# EAGLE design BIGDOGLAYOUT2 (EAGLE 7.2.0)
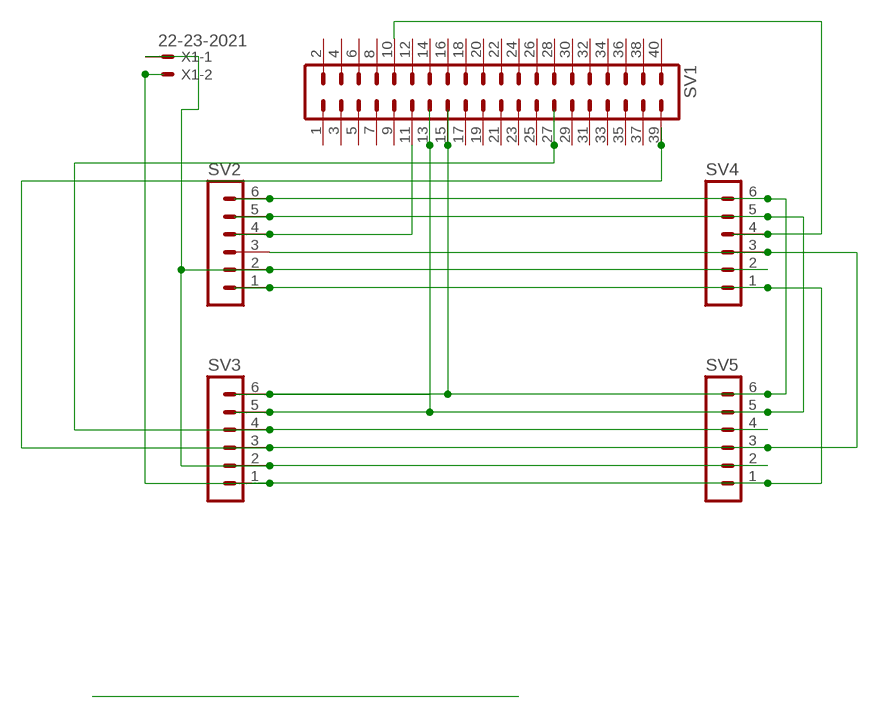
[diagram p0: schematic, sheet 1]

## Parts
SV1  MA20-2  [MA20-2]
SV2  MA06-1  [MA06-1]
SV3  MA06-1  [MA06-1]
SV4  MA06-1  [MA06-1]
SV5  MA06-1  [MA06-1]
X1  22-23-2021  [22-23-2021]

## Nets
N$1: SV1.11 SV2.4
N$2: SV1.10 SV4.4
N$3: SV2.2 SV3.2 SV4.2 SV5.2 X1.1
N$4: SV1.15 SV2.6 SV3.6 SV4.6 SV5.6
N$6: SV1.27 SV3.4 SV5.4
N$8: SV1.39 SV2.3 SV3.3 SV4.3 SV5.3
N$9: SV1.13 SV2.5 SV3.5 SV4.5 SV5.5
N$18: SV2.1 SV3.1 SV4.1 SV5.1 X1.2
Unconnected: SV1.1 SV1.2 SV1.3 SV1.4 SV1.5 SV1.6 SV1.7 SV1.8 SV1.9 SV1.12 SV1.14 SV1.16 SV1.17 SV1.18 SV1.19 SV1.20 SV1.21 SV1.22 SV1.23 SV1.24 SV1.25 SV1.26 SV1.28 SV1.29 SV1.30 SV1.31 SV1.32 SV1.33 SV1.34 SV1.35 SV1.36 SV1.37 SV1.38 SV1.40

## Library data of the parts
SV1 = con-lstb:MA20-2: PIN HEADER; OC_FARNELL: unknown; OC_NEWARK: unknown
SV2-SV5 = con-lstb:MA06-1: PIN HEADER; OC_FARNELL: unknown; OC_NEWARK: unknown
X1 = con-molex:22-23-2021: .100" (2.54mm) Center Header - 2 Pin; MF: MOLEX; MPN: 22-23-2021; OC_FARNELL: 1462926; OC_NEWARK: 25C3832

## Board
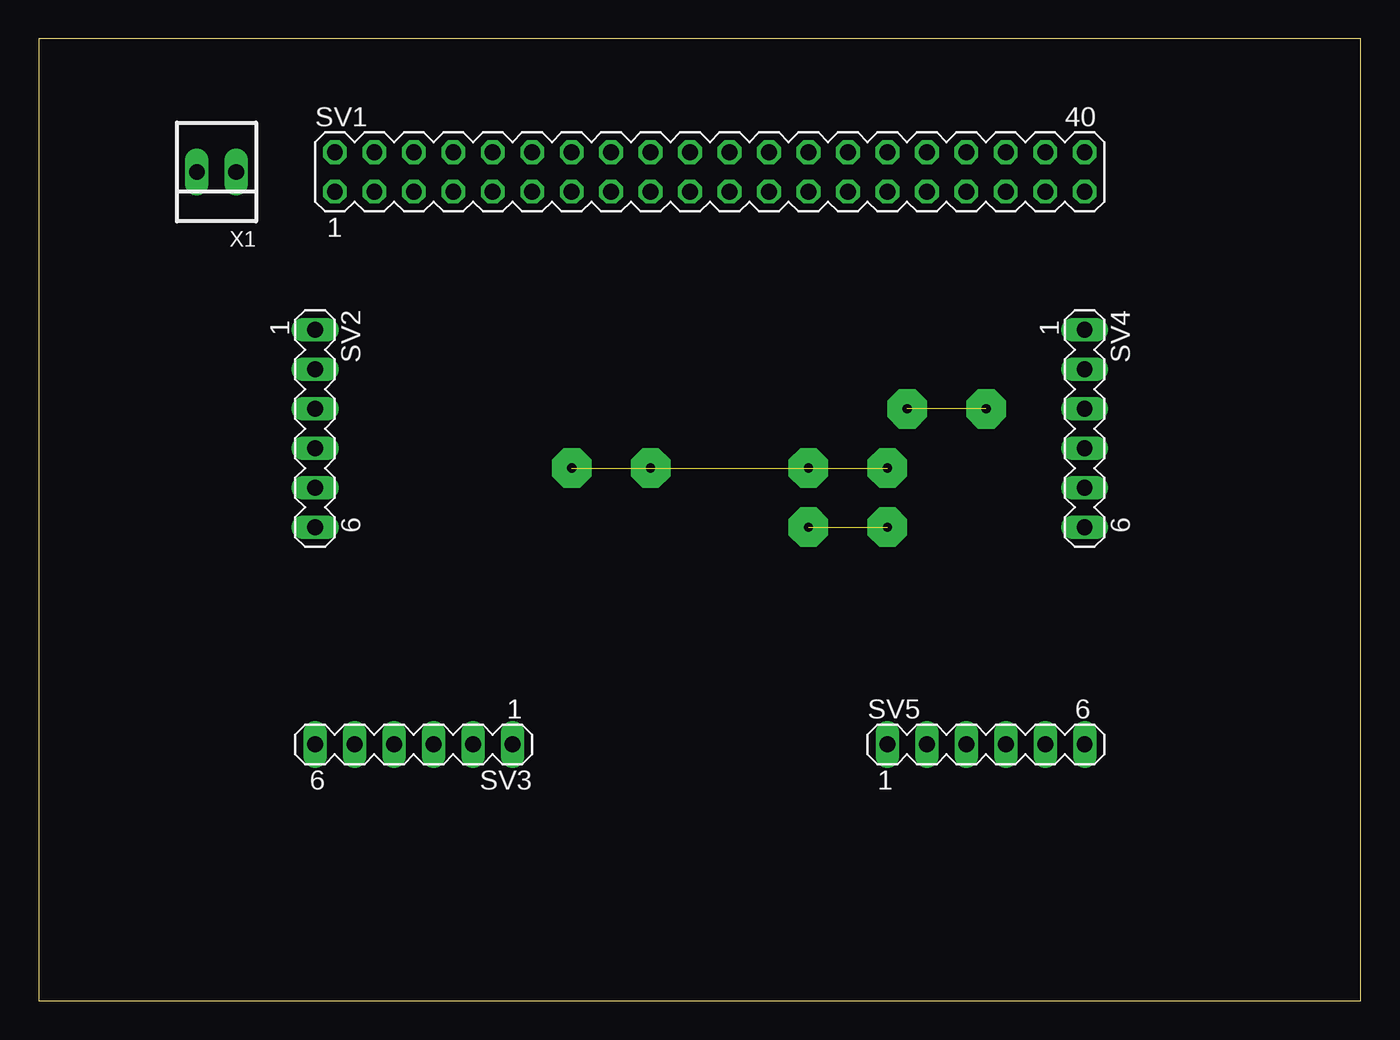
[diagram p1: board, top side]
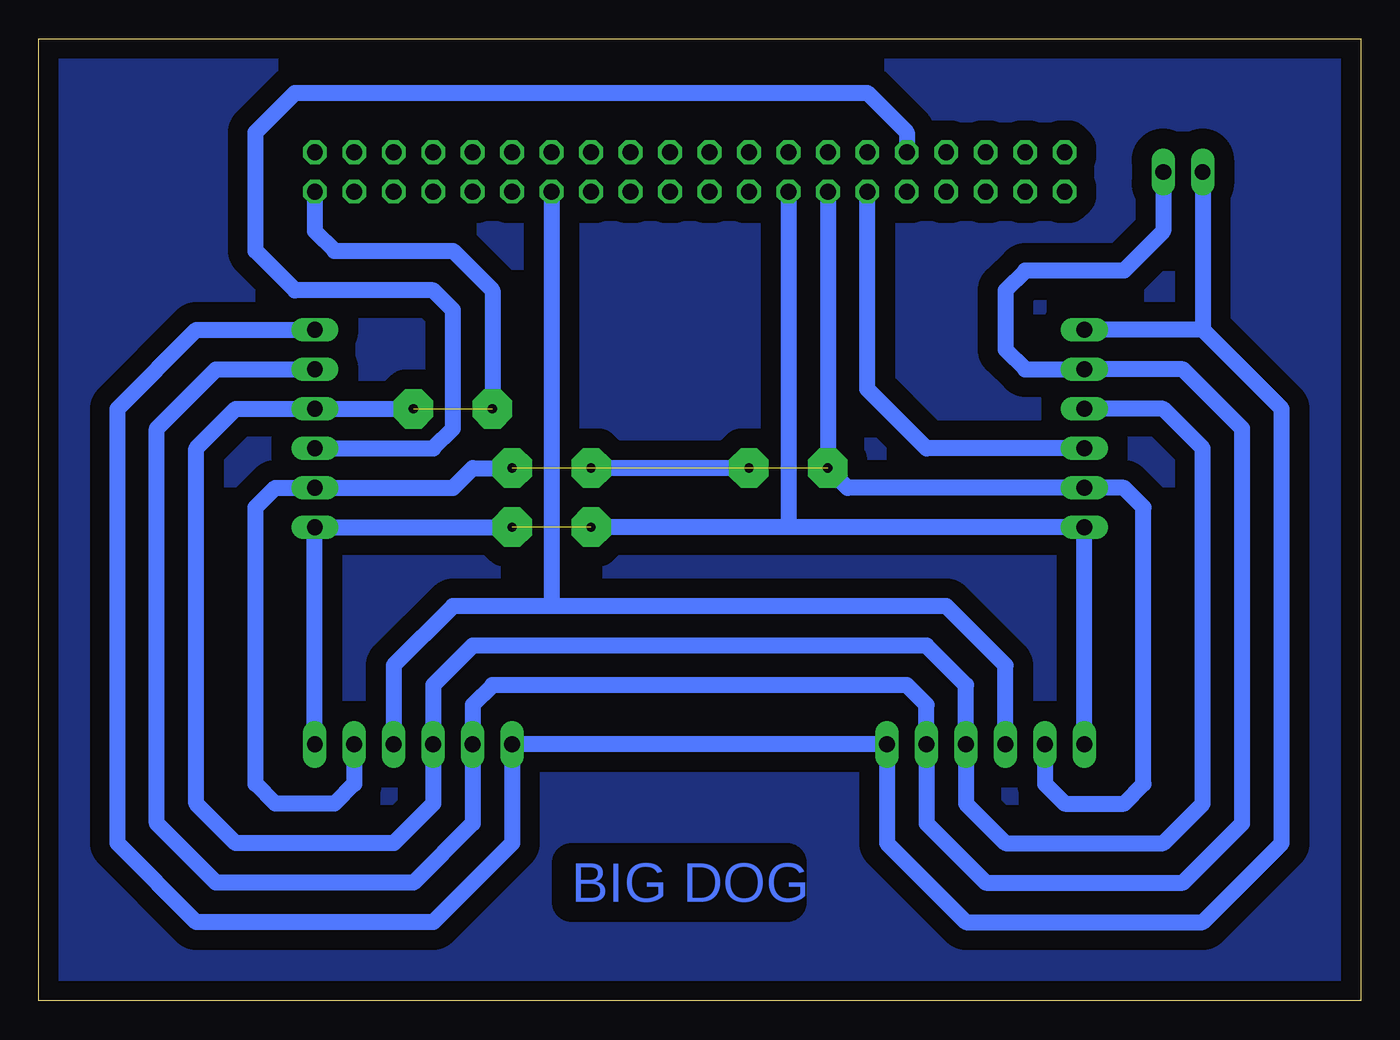
[diagram p2: board, bottom side, seen from below]

Size 85.07 x 61.9 mm. Coordinates in mm from the lower left corner, seen from the top.
Outline: 0,0 85.07,0 85.07,61.9 0,61.9 0,0
Copper layers (1*16): Top 0.035mm / dielectric 1.5mm / Bottom 0.035mm
Design rules "default": minimum track width 10mil, minimum drill 24mil, track to track 8mil, track to pad 8mil, pad to pad 8mil, via to via 8mil, smd to smd 8mil, copper to edge 40mil, drill to drill 8mil, minimum pad ring 10mil, minimum via ring 8mil, stop-mask expansion 4mil, vias tented up to drill 0mil, thermal gap 10mil

### Footprints (pad centres in the part's own frame; a part is rotated, then mirrored left to right if it is on the bottom)
MA20-2 = drill 1.016 octagon: 1 -24.13,-1.27; 2 -24.13,1.27; 3 -21.59,-1.27; 4 -21.59,1.27; 5 -19.05,-1.27; 6 -19.05,1.27; 7 -16.51,-1.27; 8 -16.51,1.27; 9 -13.97,-1.27; 10 -13.97,1.27; 11 -11.43,-1.27; 12 -11.43,1.27; 13 -8.89,-1.27; 14 -8.89,1.27; 15 -6.35,-1.27; 16 -6.35,1.27; 17 -3.81,-1.27; 18 -3.81,1.27; 19 -1.27,-1.27; 20 -1.27,1.27; 21 1.27,-1.27; 22 1.27,1.27; 23 3.81,-1.27; 24 3.81,1.27; 25 6.35,-1.27; 26 6.35,1.27; 27 8.89,-1.27; 28 8.89,1.27; 29 11.43,-1.27; 30 11.43,1.27; 31 13.97,-1.27; 32 13.97,1.27; 33 16.51,-1.27; 34 16.51,1.27; 35 19.05,-1.27; 36 19.05,1.27; 37 21.59,-1.27; 38 21.59,1.27; 39 24.13,-1.27; 40 24.13,1.27
MA06-1 = drill 1.016 long: 1 -6.35,0; 2 -3.81,0; 3 -1.27,0; 4 1.27,0; 5 3.81,0; 6 6.35,0
22-23-2021 = drill 1 long: 1 -1.27,0; 2 1.27,0

### Placement (x,y rotation side)
SV1  43.18,53.34 0 top
SV2  17.78,36.83 270 top
SV3  24.13,16.51 180 top
SV4  67.31,36.83 270 top
SV5  60.96,16.51 0 top
X1  11.43,53.34 180 top

### Tracks (layer width: path | path; a pad name or v marks a point on that pad's centre or on a via)
N$1
  Bottom 1.016: SV2.4 27.94,35.56 31.75,39.37 SV1.11
N$2
  Bottom 1.016: SV4.4 59.69,35.56 58.42,36.83 58.42,44.45 59.69,45.72 68.58,45.72 71.12,48.26 71.12,55.88 68.58,58.42 31.75,58.42 29.21,55.88 SV1.10
N$3
  Bottom 1.016: X1.1 12.7,49.53 15.24,46.99 21.59,46.99 22.86,45.72 22.86,41.91 21.59,40.64 SV2.2 11.43,40.64 7.62,36.83 7.62,11.43 11.43,7.62 24.13,7.62 27.94,11.43 SV3.2 27.94,19.05 29.21,20.32 55.88,20.32 57.15,19.05 SV5.2 57.15,11.43 60.96,7.62 73.66,7.62 77.47,11.43 77.47,36.83 73.66,40.64 SV4.2
N$4  (via drill 0.6 pad 2.54)  (1 unrouted)
  Bottom 1.016: SV3.6 SV2.6 36.83,30.48 | SV5.6 SV4.6 v54.61,30.48 | 36.83,30.48 v49.53,30.48 | SV1.15 36.83,30.48
N$5  (via drill 0.6 pad 2.54)
  other vias: 60.96,38.1
N$6
  Bottom 1.016: SV3.4 22.86,21.59 26.67,25.4 52.07,25.4 | 52.07,25.4 58.42,25.4 62.23,21.59 SV5.4 | SV1.27 52.07,25.4
N$7  (via drill 0.6 pad 2.54)
  other vias: 54.61,34.29
N$8  (via drill 0.6 pad 2.54)  (1 unrouted)
  Bottom 1.016: SV2.3 12.7,38.1 10.16,35.56 10.16,12.7 12.7,10.16 22.86,10.16 25.4,12.7 SV3.3 25.4,20.32 27.94,22.86 57.15,22.86 59.69,20.32 SV5.3 59.69,12.7 62.23,10.16 72.39,10.16 74.93,12.7 74.93,35.56 72.39,38.1 SV4.3 60.96,38.1 | SV1.39 67.31,49.53 66.04,48.26 58.42,48.26 55.88,45.72 v55.88,38.1
N$9  (1 unrouted)
  Bottom 1.016: SV3.5 20.32,13.97 19.05,12.7 15.24,12.7 13.97,13.97 13.97,31.75 15.24,33.02 SV2.5 33.02,33.02 34.29,34.29 SV1.13 | SV5.5 64.77,13.97 66.04,12.7 69.85,12.7 71.12,13.97 71.12,31.75 69.85,33.02 SV4.5 58.42,33.02 57.15,34.29 54.61,34.29
N$11  (via drill 0.6 pad 2.54)
  Bottom 1.016: v39.37,34.29 v49.53,34.29
N$12  (via drill 0.6 pad 2.54)
  other vias: 34.29,34.29
N$14
  pour Bottom (isolate 1.27): 0,62.23 85.09,62.23 85.09,0 0,0
N$18
  Bottom 1.016: 10.16,43.18 5.08,38.1 5.08,10.16 10.16,5.08 25.4,5.08 30.48,10.16 SV3.1 SV5.1 54.61,10.16 59.69,5.08 74.93,5.08 80.01,10.16 80.01,38.1 74.93,43.18 SV4.1 | 10.16,43.18 SV2.1 | X1.2 10.16,43.18

### Text on the board
Bottom: BIG DOG